# EAGLE design AINx2 (EAGLE 6.4)
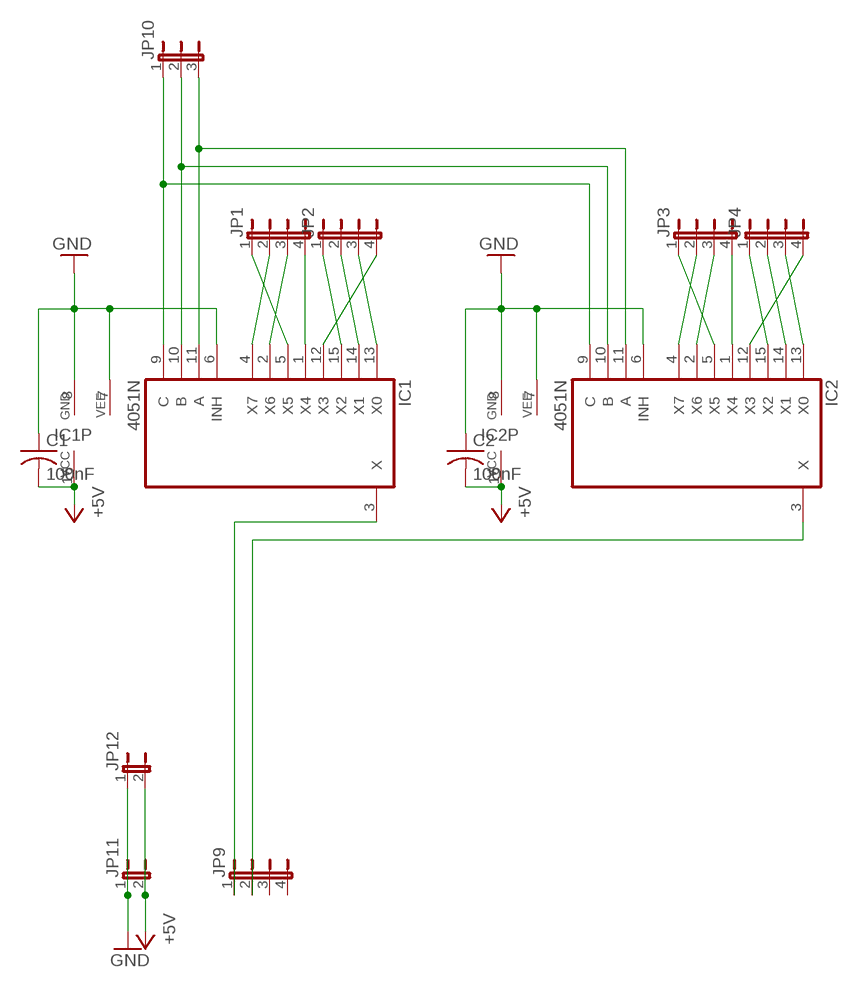
[diagram p0: schematic, sheet 1]

## Parts
C1  100nF  C-US025-025X050  [C025-025X050]
C2  100nF  C-US025-025X050  [C025-025X050]
IC1  4051N  [DIL16]
IC2  4051N  [DIL16]
JP1  JP4E  [JP4]
JP2  JP4E  [JP4]
JP3  JP4E  [JP4]
JP4  JP4E  [JP4]
JP9  JP4E  [JP4]
JP10  JP2E  [JP2]
JP11  JP1E  [JP1]
JP12  JP1E  [JP1]

## Nets
+5V: C1.2 C2.2 IC1.16(VCC) IC2.16(VCC) JP11.2 JP12.2
GND: C1.1 C2.1 IC1.6(INH) IC1.7(VEE) IC1.8(GND) IC2.6(INH) IC2.7(VEE) IC2.8(GND) JP11.1 JP12.1
N$1: IC1.1(X4) JP1.4
N$2: IC1.2(X6) JP1.3
N$3: IC1.9(C) IC2.9(C) JP10.1
N$4: IC1.10(B) IC2.10(B) JP10.2
N$5: IC1.11(A) IC2.11(A) JP10.3
N$6: IC1.4(X7) JP1.2
N$7: IC1.5(X5) JP1.1
N$8: IC1.15(X2) JP2.1
N$9: IC1.14(X1) JP2.2
N$10: IC1.13(X0) JP2.3
N$11: IC1.12(X3) JP2.4
N$13: IC2.1(X4) JP3.4
N$14: IC2.2(X6) JP3.3
N$15: IC2.4(X7) JP3.2
N$16: IC2.5(X5) JP3.1
N$17: IC2.15(X2) JP4.1
N$19: IC2.14(X1) JP4.2
N$20: IC2.13(X0) JP4.3
N$21: IC2.12(X3) JP4.4
N$38: IC1.3(X) JP9.1
N$39: IC2.3(X) JP9.2
Unconnected: JP9.3 JP9.4

## Library data of the parts
C1 C2 = rcl:C-US: CAPACITOR, American symbol
IC1 IC2 = 40xx:4051: 8-channel ANALOG MULTIPLEXER
JP1-JP4 JP9 = jumper:JP4E: JUMPER
JP10 = jumper:JP2E: JUMPER
JP11 JP12 = jumper:JP1E: JUMPER

## Board
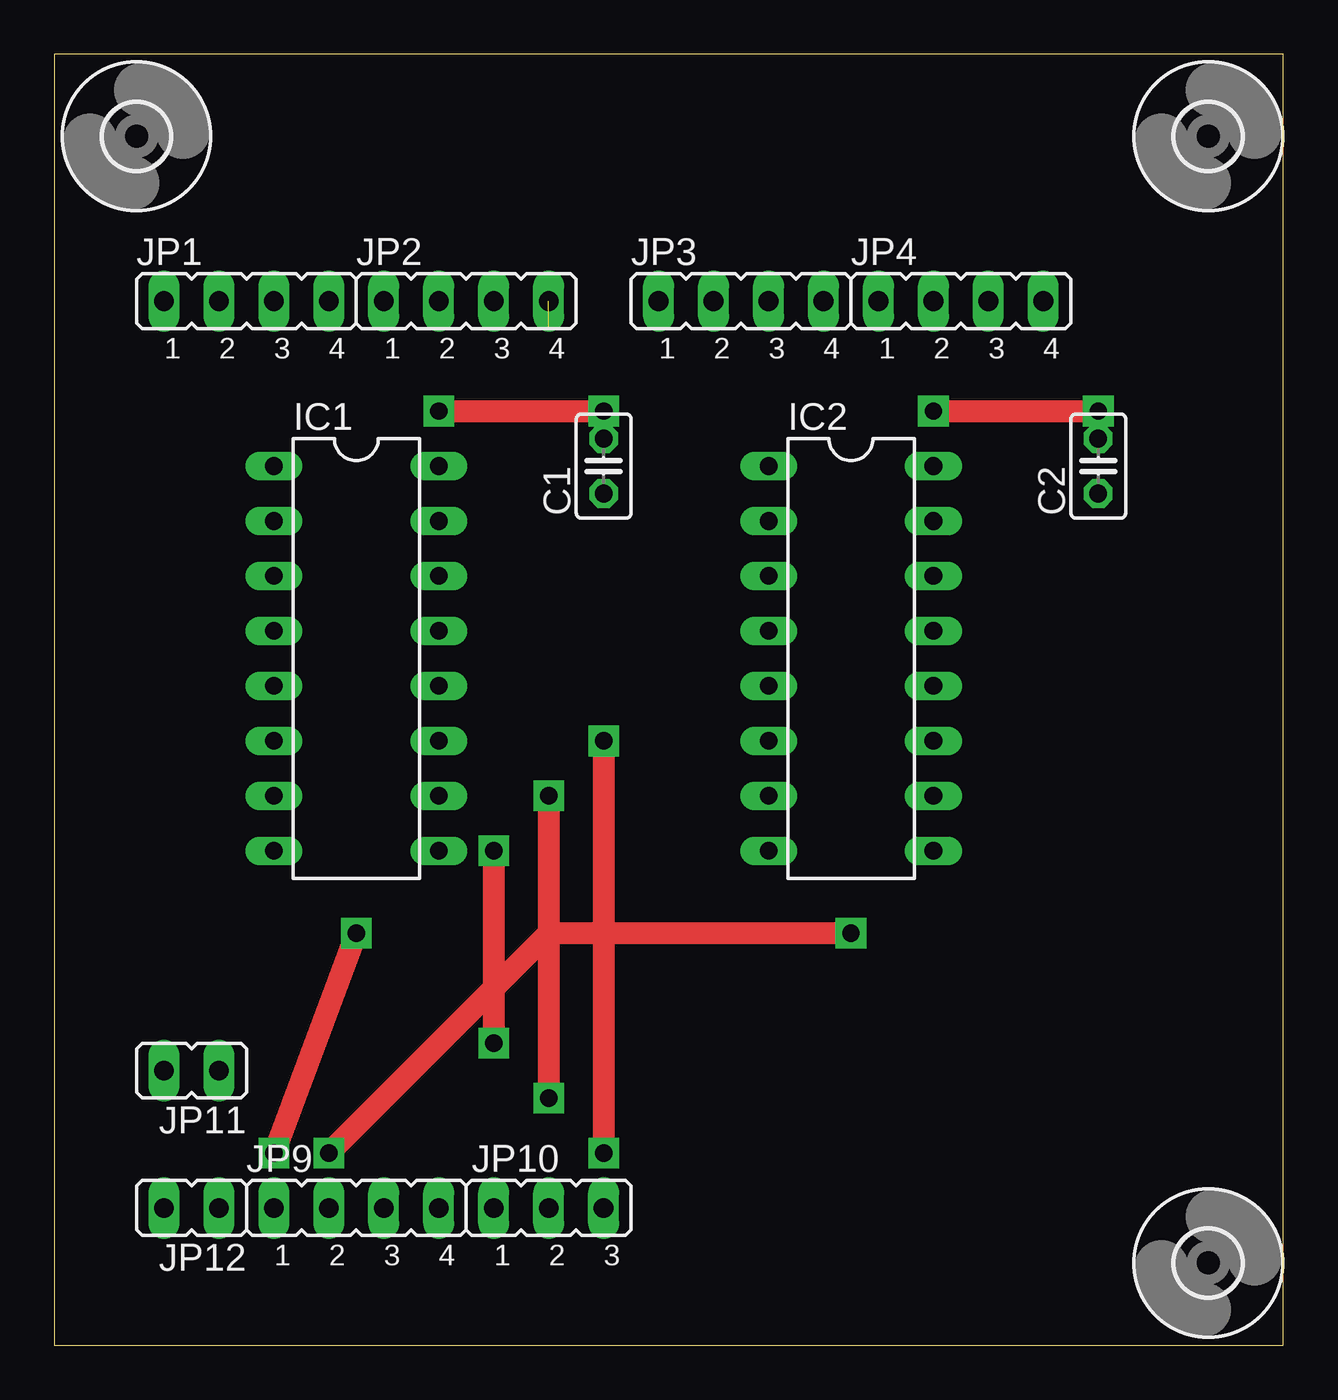
[diagram p1: board, top side]
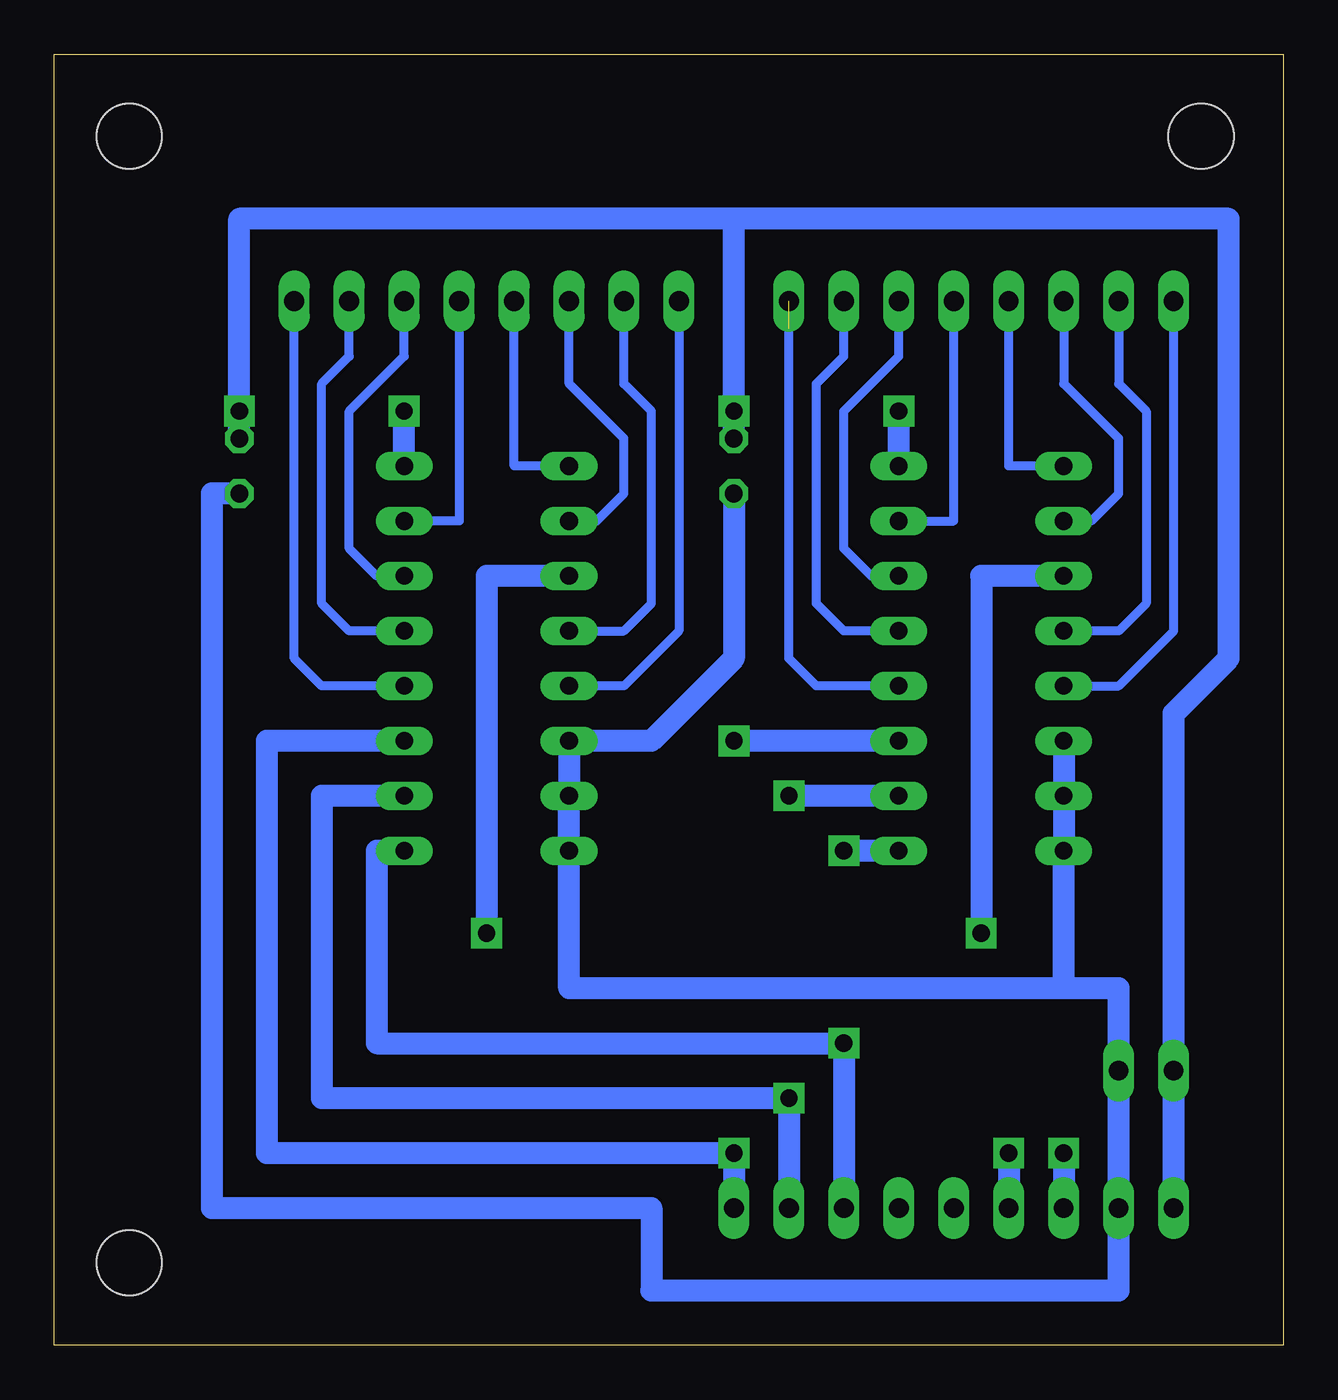
[diagram p2: board, bottom side, seen from below]

Size 56.82 x 59.68 mm. Coordinates in mm from the lower left corner, seen from the top.
Outline: 0,0 56.82,0 56.82,59.68 0,59.68 0,0
Copper layers (1*16): Top 0.035mm / dielectric 1.5mm / Bottom 0.035mm
Design rules "default": minimum track width 10mil, minimum drill 24mil, track to track 8mil, track to pad 8mil, pad to pad 8mil, via to via 8mil, smd to smd 8mil, copper to edge 40mil, drill to drill 8mil, minimum pad ring 10mil, minimum via ring 8mil, stop-mask expansion 4mil, vias tented up to drill 0mil, thermal gap 10mil

### Footprints (pad centres in the part's own frame; a part is rotated, then mirrored left to right if it is on the bottom)
C025-025X050 = drill 0.813 octagon: 1 -1.27,0; 2 1.27,0
DIL16 = drill 0.813 long: 1 -8.89,-3.81; 2 -6.35,-3.81; 3 -3.81,-3.81; 4 -1.27,-3.81; 5 1.27,-3.81; 6 3.81,-3.81; 7 6.35,-3.81; 8 8.89,-3.81; 9 8.89,3.81; 10 6.35,3.81; 11 3.81,3.81; 12 1.27,3.81; 13 -1.27,3.81; 14 -3.81,3.81; 15 -6.35,3.81; 16 -8.89,3.81
JP4 = drill 0.914 long: 1 -3.81,0; 2 -1.27,0; 3 1.27,0; 4 3.81,0
JP2 = drill 0.914 long: 1 -2.54,0; 2 0,0; 3 2.54,0
JP1 = drill 0.914 long: 1 0,-1.27; 2 0,1.27
3,0 = hole 3: 0,0

### Placement (x,y rotation side)
C1  25.4,40.64 90 top
C2  48.26,40.64 90 top
IC1  13.97,31.75 270 top
IC2  36.83,31.75 270 top
JP1  8.89,48.26 0 top
JP2  19.05,48.26 0 top
JP3  31.75,48.26 0 top
JP4  41.91,48.26 0 top
JP9  13.97,6.35 0 top
JP10  22.86,6.35 0 top
JP11  6.35,12.7 90 top
JP12  6.35,6.35 90 top
U$1  [3,0]  3.81,55.88 0 top
U$2  [3,0]  53.34,55.88 0 top
U$3  [3,0]  53.34,3.81 0 top

### Tracks (layer width: path | path; a pad name or v marks a point on that pad's centre or on a via)
+5V  (via drill 0.8 pad 1.42)
  Top 1.016: v40.64,43.18 v48.26,43.18 | v17.78,43.18 v25.4,43.18
  Bottom 1.016: JP12.2 JP11.2 5.08,29.21 2.54,31.75 2.54,52.07 25.4,52.07 | 25.4,52.07 48.26,52.07 v48.26,43.18 C2.2 | IC2.16 v40.64,43.18 | IC1.16 v17.78,43.18 | 25.4,52.07 v25.4,43.18 C1.2
GND
  Bottom 1.016: IC1.6 IC1.7 IC1.8 10.16,16.51 | 10.16,16.51 7.62,16.51 JP11.1 JP12.1 7.62,2.54 29.21,2.54 29.21,6.35 49.53,6.35 49.53,39.37 C2.1 | C1.1 25.4,31.75 29.21,27.94 IC2.6 IC2.7 IC2.8 33.02,16.51 10.16,16.51
N$1
  Bottom 0.406: IC1.1 12.7,40.64 JP1.4
N$2
  Bottom 0.406: IC1.2 8.89,38.1 7.62,39.37 7.62,41.91 10.16,44.45 JP1.3
N$3  (via drill 0.8 pad 1.42)
  Top 1.016: v20.32,22.86 v20.32,13.97
  Bottom 1.016: IC1.9 v20.32,22.86 | JP10.1 v20.32,13.97 41.91,13.97 41.91,22.86 IC2.9
N$4  (via drill 0.8 pad 1.42)
  Top 1.016: v22.86,25.4 v22.86,11.43
  Bottom 1.016: IC1.10 v22.86,25.4 | JP10.2 v22.86,11.43 44.45,11.43 44.45,25.4 IC2.10
N$5  (via drill 0.8 pad 1.42)
  Top 1.016: v25.4,27.94 v25.4,8.89
  Bottom 1.016: IC1.11 v25.4,27.94 | JP10.3 v25.4,8.89 46.99,8.89 46.99,27.94 IC2.11
N$6
  Bottom 0.406: JP1.2 7.62,44.45 6.35,43.18 6.35,34.29 7.62,33.02 IC1.4
N$7
  Bottom 0.406: IC1.5 7.62,30.48 5.08,33.02 JP1.1
N$8
  Bottom 0.406: IC1.15 15.24,38.1 JP2.1
N$9
  Bottom 0.406: IC1.14 19.05,35.56 20.32,36.83 20.32,43.18 17.78,45.72 JP2.2
N$10
  Bottom 0.406: IC1.13 20.32,33.02 21.59,34.29 21.59,44.45 20.32,45.72 JP2.3
N$11  (1 unrouted)
  Bottom 0.406: IC1.12 21.59,30.48 22.86,31.75 22.86,46.99
N$13
  Bottom 0.406: IC2.1 35.56,40.64 JP3.4
N$14
  Bottom 0.406: IC2.2 31.75,38.1 30.48,39.37 30.48,41.91 33.02,44.45 JP3.3
N$15
  Bottom 0.406: IC2.4 30.48,33.02 29.21,34.29 29.21,43.18 30.48,44.45 JP3.2
N$16
  Bottom 0.406: JP3.1 27.94,33.02 30.48,30.48 IC2.5
N$17
  Bottom 0.406: JP4.1 38.1,38.1 IC2.15
N$19
  Bottom 0.406: IC2.14 41.91,35.56 43.18,36.83 43.18,43.18 40.64,45.72 JP4.2
N$20
  Bottom 0.406: IC2.13 43.18,33.02 44.45,34.29 44.45,44.45 43.18,45.72 JP4.3
N$21
  Bottom 0.406: IC2.12 44.45,30.48 45.72,31.75 JP4.4
N$38  (via drill 0.8 pad 1.42)
  Top 1.016: v13.97,19.05 v10.16,8.89
  Bottom 1.016: IC1.3 13.97,35.56 v13.97,19.05 | v10.16,8.89 JP9.1
N$39  (via drill 0.8 pad 1.42)
  Top 1.016: v36.83,19.05 22.86,19.05 v12.7,8.89
  Bottom 1.016: IC2.3 36.83,35.56 v36.83,19.05 | v12.7,8.89 JP9.2